# Altium schematic sheet CH573_KIT_main.SchDoc
size A4; SheetNumber: 1; SheetTotal: 1
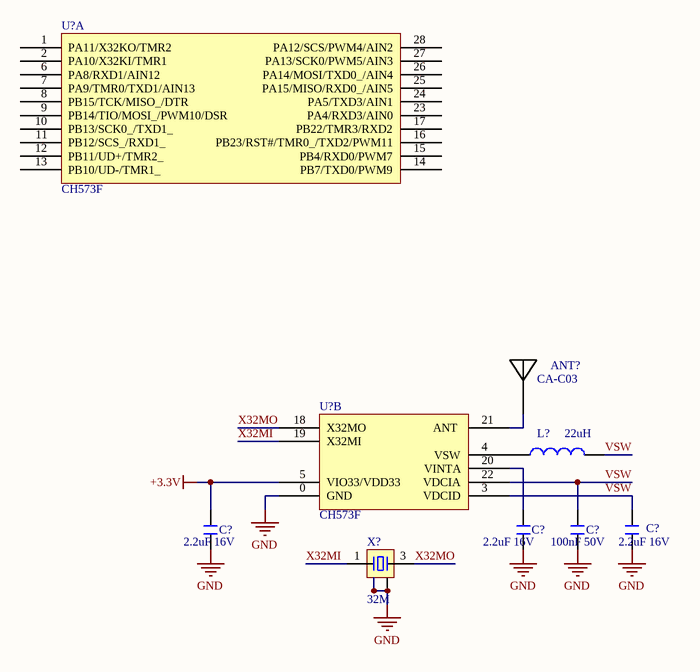
[diagram p0: CH573_KIT_main.SchDoc]

## Parts
(Parts that share a designator on the sheet are numbered #1, #2 ... from top to bottom, then left to right.)
ANT?  CA-C03  [CA-C03]
C?#1  2.2uF 16V  [C 0603_L]
C?#2  2.2uF 16V  [C 0603_L]
C?#3  100nF 50V  [C 0603_L]
C?#4  2.2uF 16V  [C 0603_L]
L?  22uH  [NLV25T]
U?#1  CH573F  [QFN28 4*4]  (part A of 2)
U?#2  CH573F  [QFN28 4*4]  (part B of 2)
X?  32M  [OSC 1612-4P]

## Nets
+3.3V: C?#1.2 U?#2.5(VIO33/VDD33)
GND: C?#1.1 C?#2.1 C?#3.1 C?#4.1 U?#2.0(GND) X?.2 X?.4
VSW: C?#3.2 C?#4.2 L?.2 U?#2.3(VDCID) U?#2.22(VDCIA)
X32MI: U?#2.19(X32MI) X?.1
X32MO: U?#2.18(X32MO) X?.3
NetANT?_1: ANT?.1 U?#2.21(ANT)
NetC?#2_2: C?#2.2 U?#2.20(VINTA)
NetL?_1: L?.1 U?#2.4(VSW)

Not connected (* = marked no-connect by the designer): U?#1 1(PA11/X32KO/TMR2) 2(PA10/X32KI/TMR1) 6(PA8/RXD1/AIN12) 7(PA9/TMR0/TXD1/AIN13) 8(PB15/TCK/MISO_/DTR) 9(PB14/TIO/MOSI_/PWM10/DSR) 10(PB13/SCK0_/TXD1__) 11(PB12/SCS_/RXD1_) 12(PB11/UD+/TMR2_) 13(PB10/UD-/TMR1_) 14(PB7/TXD0/PWM9) 15(PB4/RXD0/PWM7) 16(PB23/RST#/TMR0_/TXD2/PWM11) 17(PB22/TMR3/RXD2) 23(PA4/RXD3/AIN0) 24(PA5/TXD3/AIN1) 25(PA15/MISO/RXD0_/AIN5) 26(PA14/MOSI/TXD0_/AIN4) 27(PA13/SCK0/PWM5/AIN3) 28(PA12/SCS/PWM4/AIN2)

## Library data of the parts
ANT? = ANT1: PCB板载天线; 版权归属: 封装库来自淘宝 ID：黄晶宝石; BOM名称: PCB板载天线; 技术支持，联系售后: https://shop463601444.taobao.com
C?#1-C?#4 = C: 贴片电容; BOM名称: 无极性贴片电容; 优秀评价可免费更新: 联系淘宝ID：黄晶宝石，获取更新版封装库; 卖家免费技术支持，联系售后: 唯一出售店铺网址https://shop463601444.taobao.com; 本封装库来自淘宝卖家 ID：黄晶宝石: 其他店铺购入均为盗版，请立即申请退款
L? = L: 小功率贴片电感; 优秀评价可免费更新: 联系淘宝ID：黄晶宝石，获取更新版封装库; 卖家免费技术支持，联系售后: 唯一出售店铺网址https://shop463601444.taobao.com; 本封装库来自淘宝卖家 ID：黄晶宝石: 其他店铺购入均为盗版，请立即申请退款; BOM名称: 小功率贴片电感
X? = XTAL-4P: 4脚无源晶振; 版权归属: 封装库来自淘宝卖家 ID：黄晶宝石; 优秀评价可免费更新: 联系淘宝ID：黄晶宝石，获取更新版封装库; 卖家免费技术支持，联系售后: 唯一出售店铺网址https://shop463601444.taobao.com; 封装库来自淘宝卖家 ID：黄晶宝石: 其他店铺购入均为盗版，请立即申请退款; BOM名称: 4脚无源晶振